# EAGLE design Charlieplex 5x4 (EAGLE 7.6.0)
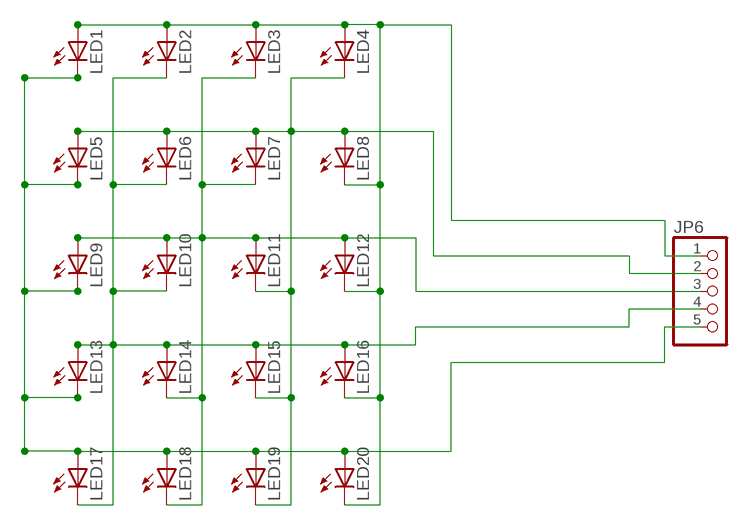
[diagram p0: schematic, sheet 1]

## Parts
JP6  PINHD-1X5  [1X05]
LED1  LED3MM  [LED3MM]
LED2  LED3MM  [LED3MM]
LED3  LED3MM  [LED3MM]
LED4  LED3MM  [LED3MM]
LED5  LED3MM  [LED3MM]
LED6  LED3MM  [LED3MM]
LED7  LED3MM  [LED3MM]
LED8  LED3MM  [LED3MM]
LED9  LED3MM  [LED3MM]
LED10  LED3MM  [LED3MM]
LED11  LED3MM  [LED3MM]
LED12  LED3MM  [LED3MM]
LED13  LED3MM  [LED3MM]
LED14  LED3MM  [LED3MM]
LED15  LED3MM  [LED3MM]
LED16  LED3MM  [LED3MM]
LED17  LED3MM  [LED3MM]
LED18  LED3MM  [LED3MM]
LED19  LED3MM  [LED3MM]
LED20  LED3MM  [LED3MM]

## Nets
N$1: JP6.1 LED1.A LED2.A LED3.A LED4.A LED8.K(C) LED12.K(C) LED16.K(C) LED20.K(C)
N$2: JP6.2 LED4.K(C) LED5.A LED6.A LED7.A LED8.A LED11.K(C) LED15.K(C) LED19.K(C)
N$3: JP6.3 LED3.K(C) LED7.K(C) LED9.A LED10.A LED11.A LED12.A LED14.K(C) LED18.K(C)
N$4: JP6.4 LED2.K(C) LED6.K(C) LED10.K(C) LED13.A LED14.A LED15.A LED16.A LED17.K(C)
N$5: JP6.5 LED1.K(C) LED5.K(C) LED9.K(C) LED13.K(C) LED17.A LED18.A LED19.A LED20.A

## Library data of the parts
JP6 = pinhead:PINHD-1X5: PIN HEADER
LED1-LED20 = led:LED: LED OSRAM: - CHIPLED LG R971, LG N971, LY N971, LG Q971, LY Q971, LO R971, LY R971 LH N974, LH R974 LS Q976, LO Q976, LY Q976 LO Q996 - Hyper CHIPLED LW Q18S LB Q993, LB Q99A, LB R99A - SideLED LS A670, LO A670, LY A670, LG A670, LP A670 LB A673, LV A673, LT A673, LW A673 LH A674 LY A675 LS A676, LA A676, LO A676, LY A676, LW A676 LS A679, LY A679, LG A679 - Hyper Micro SIDELED® LS Y876, LA Y876, LO Y876, LY Y876 LT Y87S - SmartLED LW L88C, LW L88S LB L89C, LB L89S, LG L890 LS L89K, LO L89K, LY L89K LS L896, LA L896, LO L896, LY L896 - TOPLED LS T670, LO T670, LY T670, LG T670, LP T670 LSG T670, LSP T670, LSY T670, LOP T670, LYG T670 LG T671, LOG T671, LSG T671 LB T673, LV T673, LT T673, LW T673 LH T674 LS T676, LA T676, LO T676, LY T676, LB T676, LH T676, LSB T676, LW T676 LB T67C, LV T67C, LT T67C, LS T67K, LO T67K, LY T67K, LW E67C LS E67B, LA E67B, LO E67B, LY E67B, LB E67C, LV E67C, LT E67C LW T67C LS T679, LY T679, LG T679 LS T770, LO T770, LY T770, LG T770, LP T770 LB T773, LV T773, LT T773, LW T773 LH T774 LS E675, LA E675, LY E675, LS T675 LS T776, LA T776, LO T776, LY T776, LB T776 LHGB T686 LT T68C, LB T68C - Hyper Mini TOPLED® LB M676 - Mini TOPLED Santana® LG M470 LS M47K, LO M47K, LY M47K Source: http://www.osram.convergy.de LUXEON: - LUMILED® LXK2-PW12-R00, LXK2-PW12-S00, LXK2-PW14-U00, LXK2-PW14-V00 LXK2-PM12-R00, LXK2-PM12-S00, LXK2-PM14-U00 LXK2-PE12-Q00, LXK2-PE12-R00, LXK2-PE12-S00, LXK2-PE14-T00, LXK2-PE14-U00 LXK2-PB12-K00, LXK2-PB12-L00, LXK2-PB12-M00, LXK2-PB14-N00, LXK2-PB14-P00, LXK2-PB14-Q00 LXK2-PR12-L00, LXK2-PR12-M00, LXK2-PR14-Q00, LXK2-PR14-R00 LXK2-PD12-Q00, LXK2-PD12-R00, LXK2-PD12-S00 LXK2-PH12-R00, LXK2-PH12-S00 LXK2-PL12-P00, LXK2-PL12-Q00, LXK2-PL12-R00 Source: www.luxeon.com KINGBRIGHT: KA-3528ASYC Source: www.kingbright.com

## Board
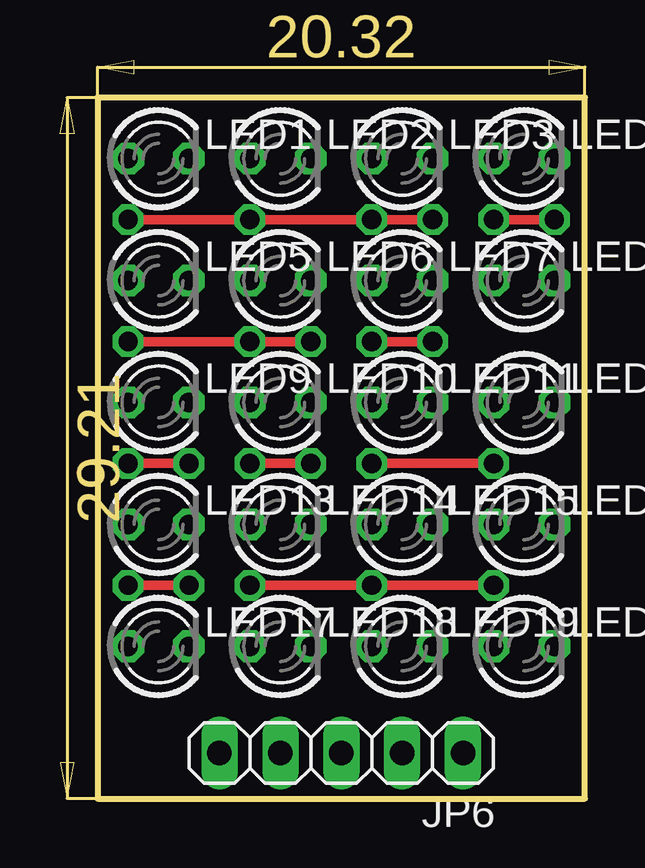
[diagram p1: board, top side]
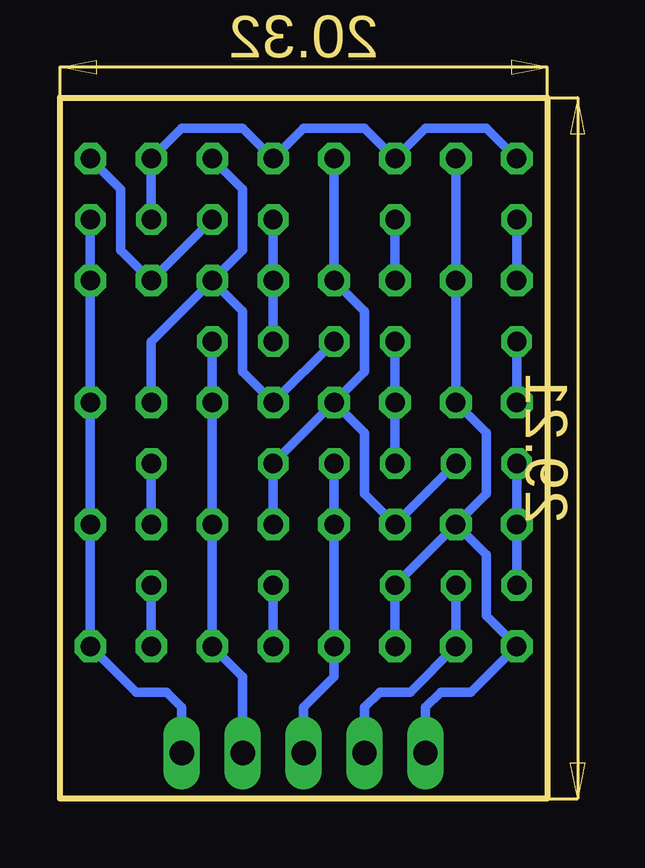
[diagram p2: board, bottom side, seen from below]

Size 20.32 x 29.21 mm. Coordinates in mm from the lower left corner, seen from the top.
Outline: 0,0 20.32,0 20.32,29.21 0,29.21 0,0
Copper layers (1*16): Top 0.035mm / dielectric 1.5mm / Bottom 0.035mm
Design rules "default": minimum track width 10mil, minimum drill 24mil, track to track 8mil, track to pad 8mil, pad to pad 8mil, via to via 8mil, smd to smd 8mil, copper to edge 40mil, drill to drill 8mil, minimum pad ring 10mil, minimum via ring 8mil, stop-mask expansion 4mil, vias tented up to drill 0mil, thermal gap 10mil

### Footprints (pad centres in the part's own frame; a part is rotated, then mirrored left to right if it is on the bottom)
1X05 = drill 1.016 long: 1 -5.08,0; 2 -2.54,0; 3 0,0; 4 2.54,0; 5 5.08,0
LED3MM = drill 0.813 octagon: A -1.27,0; K 1.27,0

### Placement (x,y rotation side)
JP6  10.16,1.91 180 top
LED1  2.54,26.67 0 top
LED2  7.62,26.67 0 top
LED3  12.7,26.67 0 top
LED4  17.78,26.67 0 top
LED5  2.54,21.59 0 top
LED6  7.62,21.59 0 top
LED7  12.7,21.59 0 top
LED8  17.78,21.59 0 top
LED9  2.54,16.51 0 top
LED10  7.62,16.51 0 top
LED11  12.7,16.51 0 top
LED12  17.78,16.51 0 top
LED13  2.54,11.43 0 top
LED14  7.62,11.43 0 top
LED15  12.7,11.43 0 top
LED16  17.78,11.43 0 top
LED17  2.54,6.35 0 top
LED18  7.62,6.35 0 top
LED19  12.7,6.35 0 top
LED20  17.78,6.35 0 top

### Tracks (layer width: path | path; a pad name or v marks a point on that pad's centre or on a via)
N$1  (via drill 0.6 pad 1.27, 0.8)
  Top 0.4: v16.51,24.13 v19.05,24.13
  Bottom 0.4: LED1.A 2.54,27.94 5.08,27.94 LED2.A 7.62,27.94 10.16,27.94 LED3.A 12.7,27.94 15.24,27.94 LED4.A v16.51,24.13 | v19.05,24.13 LED8.K LED12.K LED16.K LED20.K 17.14,4.45 15.88,4.45 15.24,3.81 JP6.1
N$2  (via drill 0.6 pad 1.27, 0.8)
  Top 0.4: v1.27,24.13 v6.35,24.13 v11.43,24.13 v13.97,24.13 | v11.43,19.05 v13.97,19.05
  Bottom 0.4: LED4.K 17.78,25.4 17.78,22.86 LED8.A v13.97,24.13 | v11.43,24.13 LED7.A v11.43,19.05 | LED5.A v1.27,24.13 | LED6.A v6.35,24.13 | v13.97,19.05 LED11.K LED15.K LED19.K 12.7,5.08 JP6.2
N$3  (via drill 0.6 pad 1.27, 0.8)
  Top 0.4: v1.27,19.05 v6.35,19.05 v8.89,19.05 | v6.35,13.97 v8.89,13.97
  Bottom 0.4: LED7.K 12.7,20.32 12.7,17.78 LED11.A v8.89,19.05 | LED3.K 12.7,25.4 12.7,22.86 LED7.K | LED12.A 16.51,19.05 LED7.K | LED9.A v1.27,19.05 | v6.35,19.05 LED10.A v6.35,13.97 | v8.89,13.97 LED14.K LED18.K 8.89,5.08 10.16,3.81 JP6.3
N$4  (via drill 0.6 pad 1.27, 0.8)
  Top 0.4: v1.27,13.97 v3.81,13.97 | v11.43,13.97 v16.51,13.97 | v1.27,8.89 v3.81,8.89
  Bottom 0.4: LED10.K 7.62,15.24 7.62,12.7 LED14.A v3.81,13.97 | LED2.K LED6.K 7.62,20.32 7.62,17.78 LED10.K | LED10.K v11.43,13.97 LED15.A | v1.27,13.97 LED13.A v1.27,8.89 | LED16.A v16.51,13.97 | v3.81,8.89 LED17.K 5.71,4.45 6.99,4.45 7.62,3.81 JP6.4
N$5  (via drill 0.6 pad 1.27, 0.8)
  Top 0.4: v6.35,8.89 v11.43,8.89 v16.51,8.89
  Bottom 0.4: LED13.K 2.54,10.16 2.54,7.62 LED17.A 3.17,4.45 4.45,4.45 5.08,3.81 JP6.5 | LED1.K LED5.K LED9.K 2.54,15.24 2.54,12.7 LED13.K | LED13.K v6.35,8.89 LED18.A | LED19.A v11.43,8.89 | v16.51,8.89 LED20.A